# Altium schematic sheet STM_Power_Supply.SchDoc: STM Power Supply
size A4; DrawnBy: Marin Sinožić; Organization: Altium Limited; Address1: L3, 12a Rodborough Rd; Address2: Frenchs Forest; Address3: NSW; Address4: Australia 2086; SheetNumber: 1; SheetTotal: 6
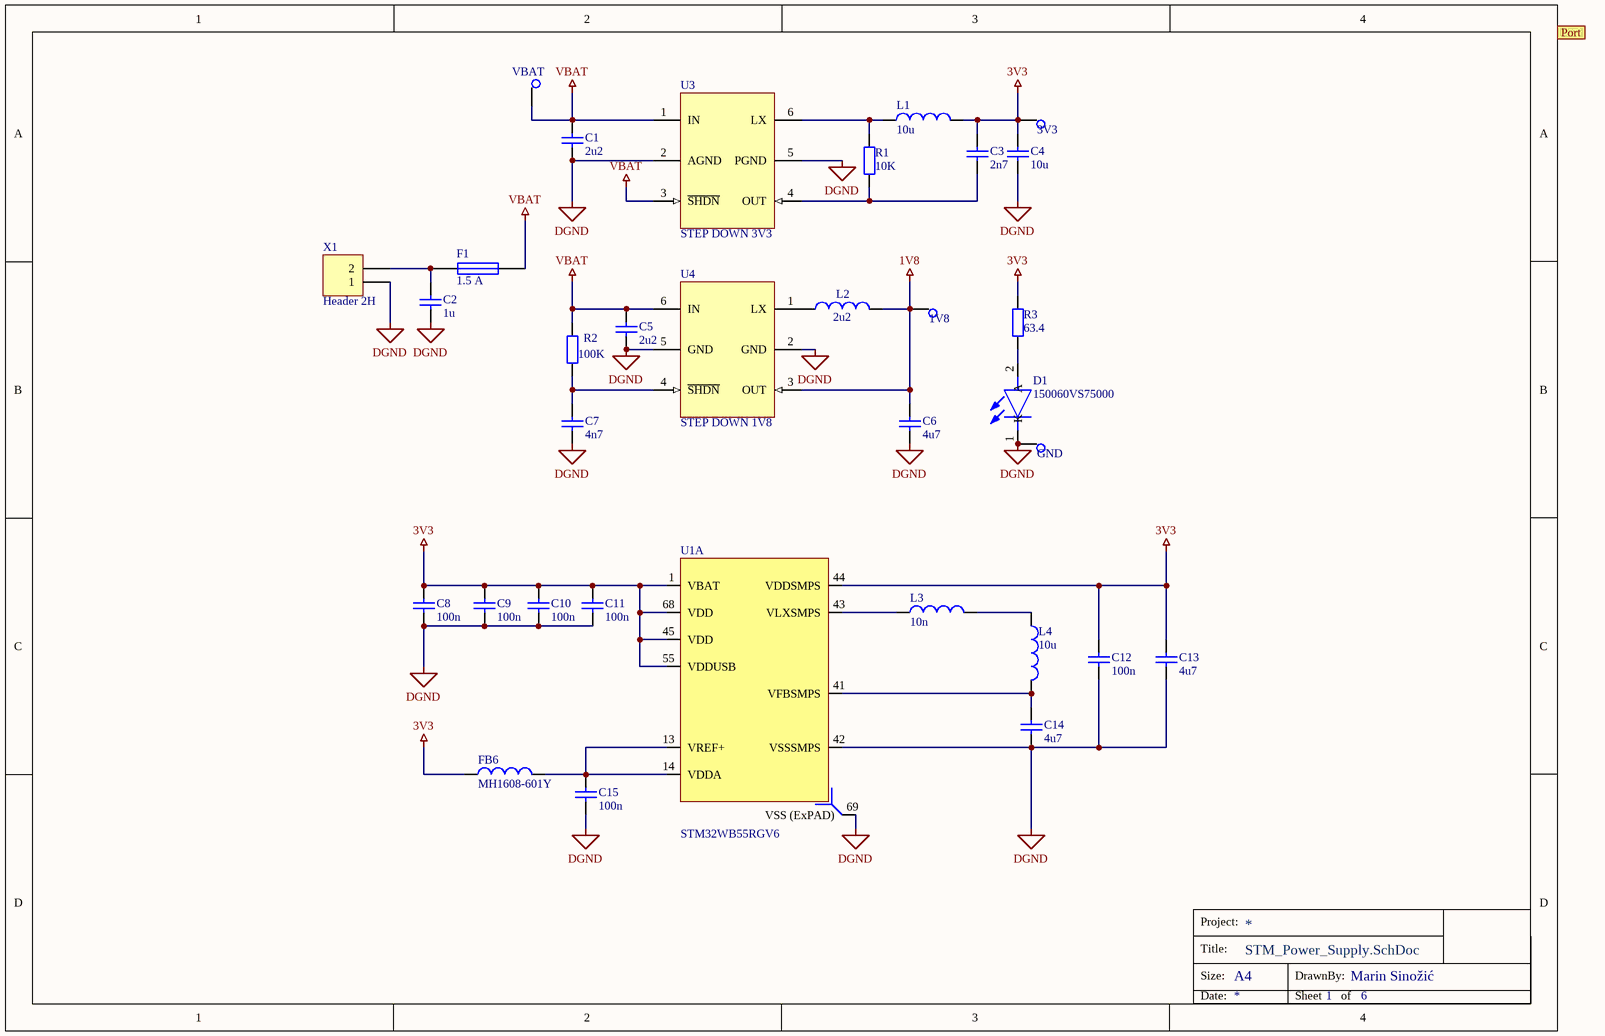
[diagram p0: STM_Power_Supply.SchDoc]

## Parts
1V8  TestPoint  [TP]  (value not drawn)
3V3  TestPoint  [TP]  (value not drawn)
C1  2u2  [0603]
C2  1u  [0805]
C3  2n7  [0603]
C4  10u  [0603]
C5  2u2  [0603]
C6  4u7  [0603]
C7  4n7  [0603]
C8  100n  [0603]
C9  100n  [0603]
C10  100n  [0603]
C11  100n  [0603]
C12  100n  [0603]
C13  4u7  [0603]
C14  4u7  [0603]
C15  100n  [0603]
D1  150060VS75000  [0603]
F1  1.5 A  [MF-USMF075-2]
FB6  MH1608-601Y  [0603]
GND  TestPoint  [TP]  (value not drawn)
L1  10u  [IND_10uH]
L2  2u2  [INDP2929X15N]
L3  10n  [0603]
L4  10u  [0805]
R1  10K  [0603]
R2  100K  [0603]
R3  63.4  [0603]
U1  STM32WB55RGV6  [VFQFPN69]  (part A of 3)
U3  STEP DOWN 3V3  [SOT95P280X145-6N]
U4  STEP DOWN 1V8  [SC70P20X21]
VBAT  TestPoint  [TP]  (value not drawn)
X1  Header 2H  [HDR1X2]

## Ports
Port

## Nets
1V8: 1V8.1 C6.2 L2.1 U4.3(OUT)
3V3: 3V3.1 C3.2 C4.2 C8.2 C9.2 C10.2 C11.2 C12.2 C13.1 FB6.1 L1.2 R3.2 U1.1(VBAT) U1.44(VDDSMPS) U1.45(VDD) U1.55(VDDUSB) U1.68(VDD)
DGND: C1.1 C2.1 C4.1 C5.1 C6.1 C7.1 C8.1 C9.1 C10.1 C11.1 C12.1 C13.2 C14.1 C15.1 D1.1(K) GND.1 U1.42(VSSSMPS) U1.69(VSS_(ExPAD)) U3.2(AGND) U3.5(PGND) U4.2(GND) U4.5(GND) X1.1
VBAT: C1.2 C5.2 F1.2 R2.2 U3.1(IN) U3.3(~{SHDN}) U4.6(IN) VBAT.1
NetC2_2: C2.2 F1.1 X1.2
NetC3_1: C3.1 R1.1 U3.4(OUT)
NetC7_2: C7.2 R2.1 U4.4(~{SHDN})
NetC14_2: C14.2 L4.2 U1.41(VFBSMPS)
NetC15_2: C15.2 FB6.2 U1.13(VREF+) U1.14(VDDA)
NetD1_2: D1.2(A) R3.1
NetL1_1: L1.1 R1.2 U3.6(LX)
NetL2_2: L2.2 U4.1(LX)
NetL3_1: L3.1 U1.43(VLXSMPS)
NetL3_2: L3.2 L4.1

## Notes on the sheet
- Project:
- Title:
- Size:
- A4
- DrawnBy:
- Date:
- Sheet
- of

## Library data of the parts
C1 C5 = Cap: CAP CER 2.2UF 25V X5R 0603; Manufacturer Part Number: 490-10731-1-ND; Value: 2u2; Supplier 1: Digi-Key; Price: 0.16
C2 = Cap: CAP CER 1UF 25V X5R 0805; Manufacturer Part Number: 311-1868-1-ND; Value: 1u; Supplier 1: Digi-Key; Price: 0.21
C3 = Cap: CAP CER 2700PF 50V X7R 0603; Manufacturer Part Number: 1276-2022-1-ND; Value: 2n7; Supplier 1: Digi-Key; Price: 0.1
C4 = Cap: CAP CER 10UF 25V X5R 0603; Manufacturer Part Number: 490-GRM188R61E106KA73JCT-ND; Value: 10u; Supplier 1: Digi-Key; Price: 0.32
C6 C13 C14 = Cap: CAP CER 4.7UF 16V X5R 0603; Manufacturer Part Number: 587-2786-1-ND; Value: 4u7; Supplier 1: Digi-Key; Price: 0.32
C7 = Cap: CAP CER 4700PF 50V X7R 0603; Manufacturer Part Number: 1276-1098-1-ND; Value: 4n7; Supplier 1: Digi-Key; Price: 0.1
C8-C12 C15 = Cap: CAP CER 0.1UF 50V X7R 0603; Manufacturer Part Number: 1276-CL10B104KB8WPNDCT-ND; Value: 100n; Supplier 1: Digi-Key; Price: 0.1
D1 = 150060VS75000: LED GREEN DIFFUSED 0603 SMD; Manufacturer Part Number: 732-12017-1-ND; Price: 0.18; Value: *; Supplier 1: Digi-Key
F1 = Fuse 1: PTC RESET FUSE 6V 750MA 1210; Manufacturer Part Number: MF-USMF075-2CT-ND; Price: 0.67; Supplier 1: Digi-Key
FB6 = MH1608-601Y: FERRITE BEAD 600 OHM 0603 1LN; Manufacturer Part Number: MH1608-601YCT-ND; Supplier 1: Digi-Key; Price: 0.1
L1 = L_0805_10uH: FIXED IND 10UH 550MA 210MOHM SMD; Manufacturer Part Number: 308-2298-1-ND; Supplier 1: Digi-Key; Value: 10u; Price: 1.23
L2 = L_0805_10uH: FIXED IND 2.2UH 1.22A 78MOHM SMD; Manufacturer Part Number: 490-15950-1-ND; Supplier 1: Digi-Key; Value: 2u2; Price: 0.36
L3 = L_0805_10uH: FIXED IND 10NH 600MA 200MOHM SMD; Manufacturer Part Number: 490-15244-1-ND; Supplier 1: Digi-Key; Value: 10n; Price: 0.14
L4 = L_0805_10uH: FIXED IND 10UH 100MA 780MOHM SMD; Manufacturer Part Number: 490-4029-1-ND; Supplier 1: Digi-Key; Value: 10u; Price: 0.25
R1 = Res2: RES SMD 10K OHM 0.5% 1/5W 0603; Manufacturer Part Number: P20397CT-ND; Value: 10K; Supplier 1: Digi-Key; Price: 0.16
R2 = Res2: RES 100 KOHMS 0.5% 1/10W 0603; Manufacturer Part Number: P123902CT-ND; Value: 100K; Supplier 1: Digi-Key; Price: 0.11
R3 = Res2: RES SMD 63.4 OHM 0.1% 1/10W 0603; Manufacturer Part Number: YAG4584CT-ND; Value: 63.4; Supplier 1: Digi-Key; Price: 0.32
U1 = STM32WB55RGV6: MCU 32-Bit STM32WB55 ARM Cortex M4 RISC 1MB Flash 1.7V to 3.6V 68-Pin VFQFPN Tray; Manufacturer Part Number: 497-18488-ND; Price: 11.67; Supplier 1: Digi-Key
U3 = MAX1921EUT33+T: IC REG BUCK 3.3V 400MA SOT23-6; Manufacturer Part Number: MAX1921EUT33+T-ND; Price: 3.34; Supplier 1: Digi-Key
U4 = MAX8640YEXT18+T: IC REG BUCK 1.8V 500MA SC70-6; Manufacturer Part Number: MAX8640YEXT18+TCT-ND; Price: 4.69; Supplier 1: Digi-Key
X1 = Header 2H: Header, 2-Pin, Right Angle